# Altium schematic sheet PowerConverter.SchDoc
size 594 x 420 mm; Address1: Address1; Address2: Address2; Address3: Address3; Address4: Address4; DocumentNumber: АБВГ.123456.001 Э3; SheetNumber: 1; SheetTotal: 2; Scale: 1:1; DocumentType: Схема электрическая принципиальная; FirstReferrence: АБВГ.123456.001
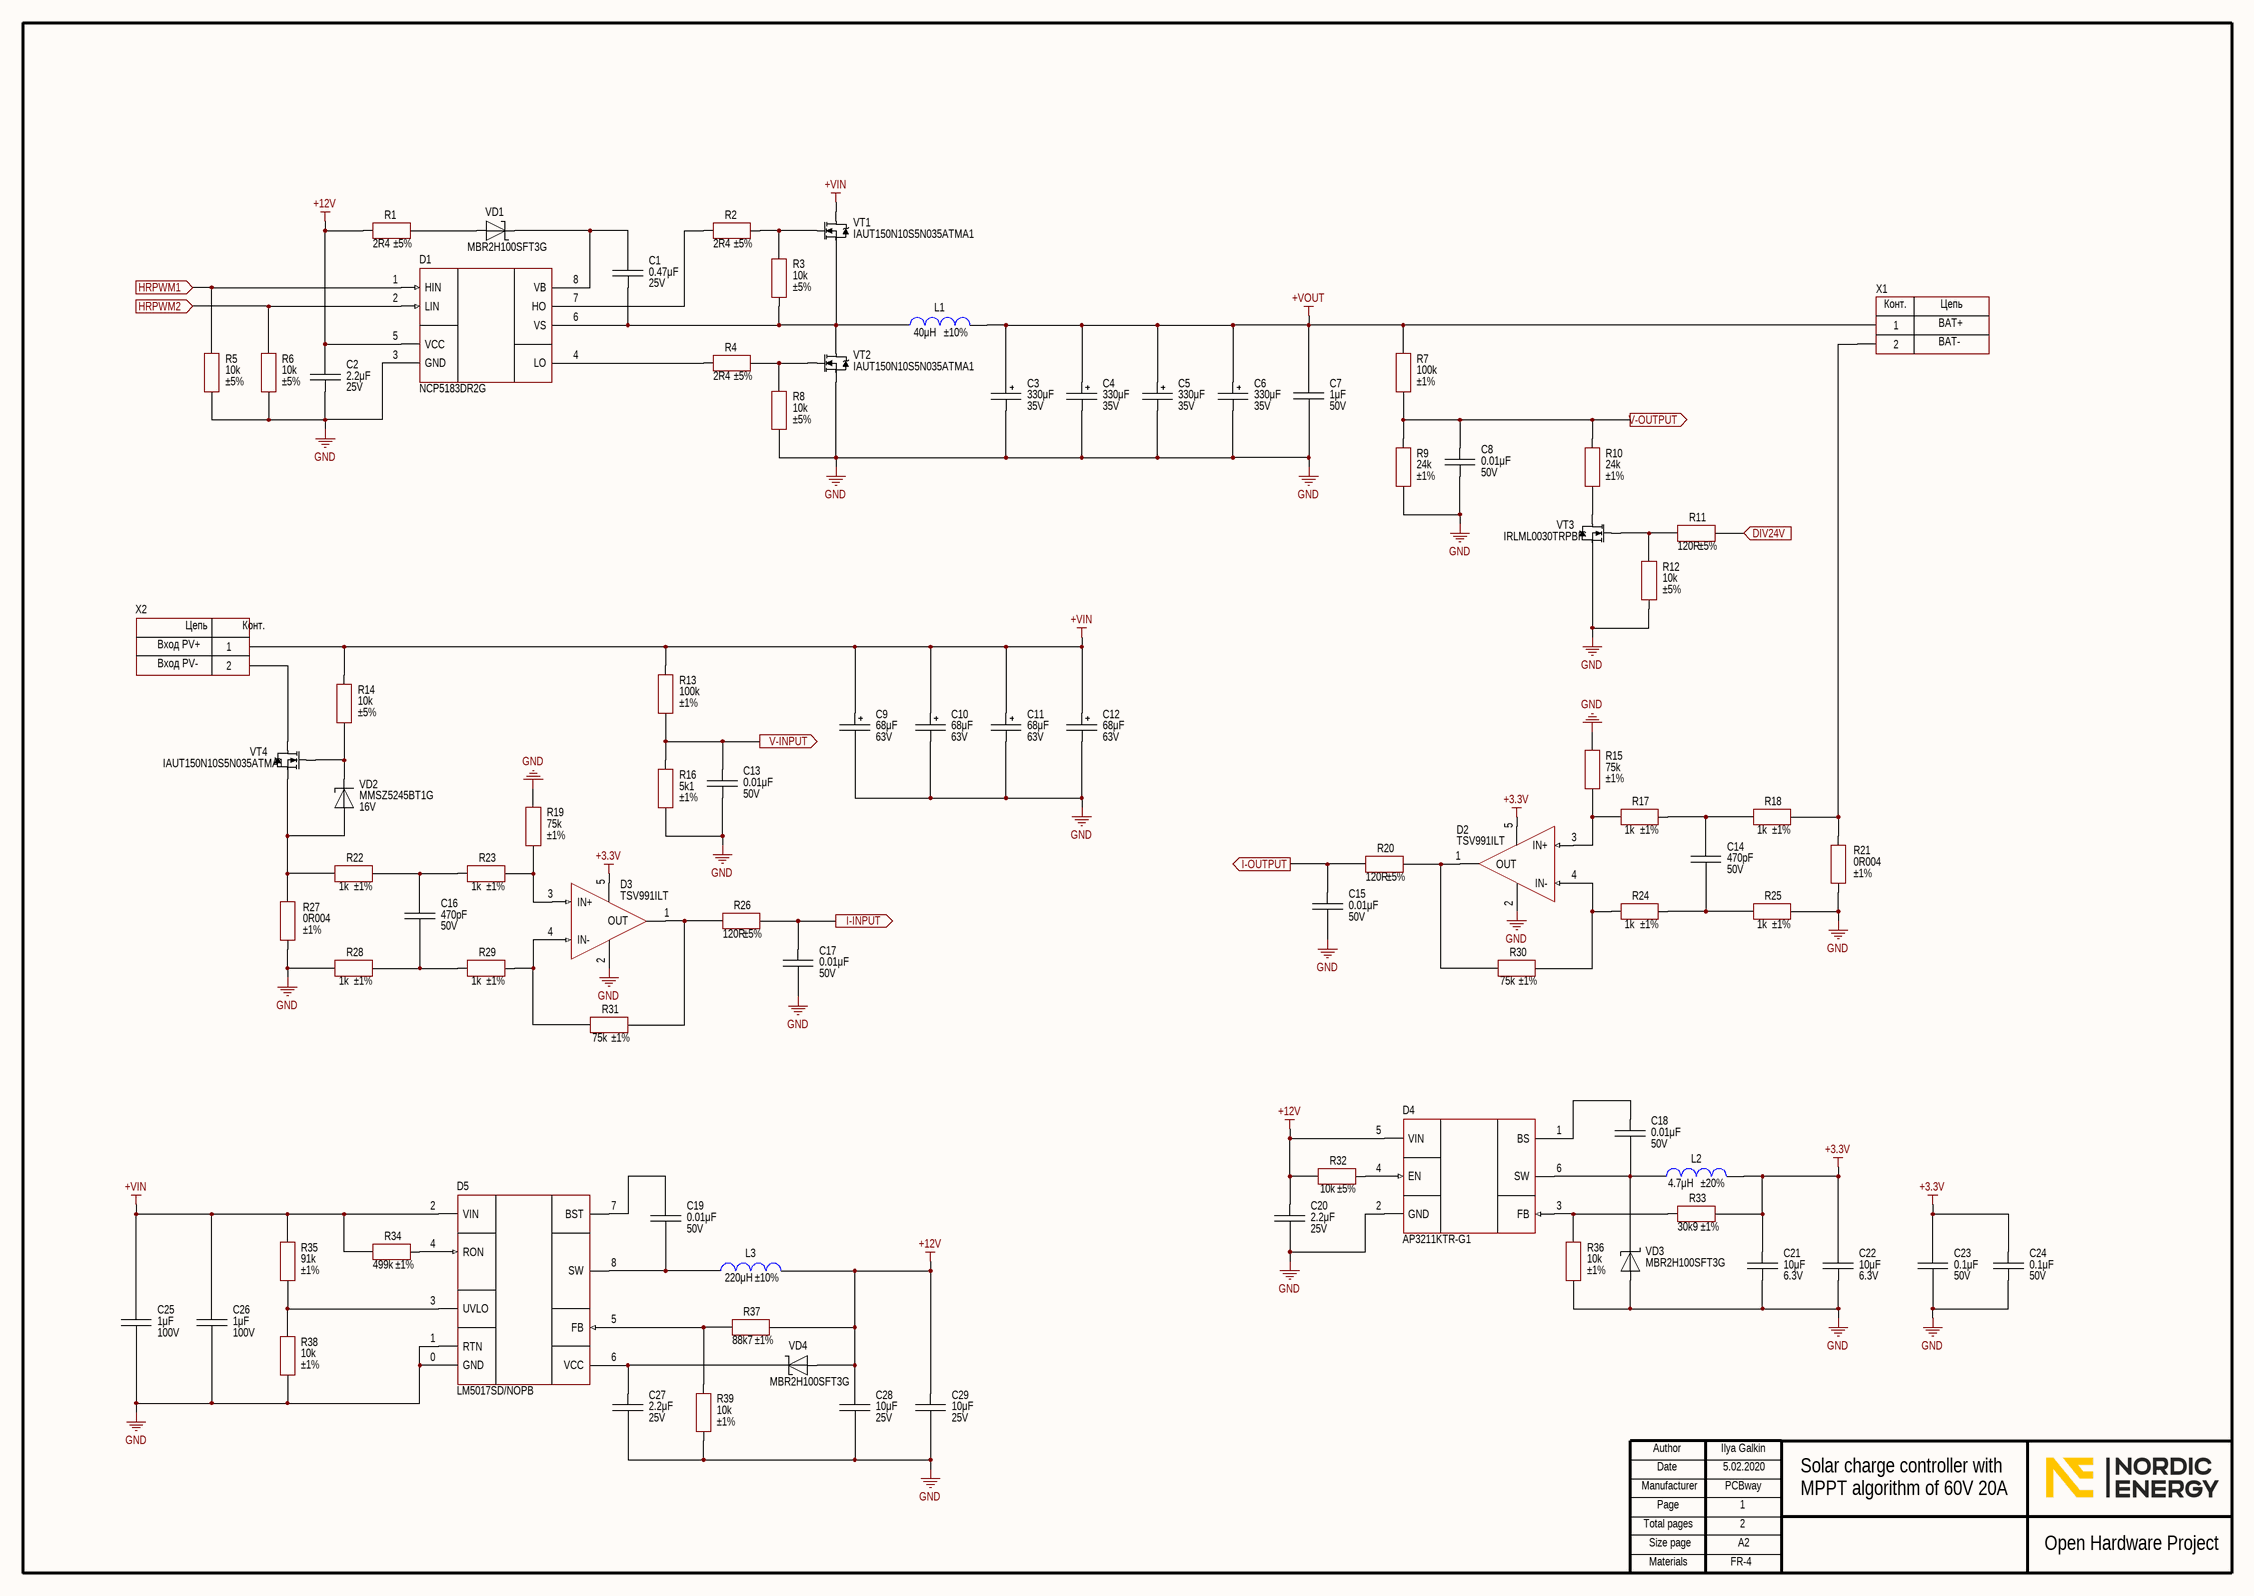
[diagram p0: PowerConverter.SchDoc]

## Parts
C1  value 0.47μF  Voltage: 25V  [CAP: 0805]
C2  value 2.2μF  Voltage: 25V  [CAP: 0805]
C3  value 330μF  Voltage: 35V  [CAP: D10C5H12.5]
C4  value 330μF  Voltage: 35V  [CAP: D10C5H12.5]
C5  value 330μF  Voltage: 35V  [CAP: D10C5H12.5]
C6  value 330μF  Voltage: 35V  [CAP: D10C5H12.5]
C7  value 1μF  Voltage: 50V  [CAP: 0805]
C8  value 0.01μF  Voltage: 50V  [CAP: 0805]
C9  value 68μF  Voltage: 63V  [CAP: D10C5H12.5]
C10  value 68μF  Voltage: 63V  [CAP: D10C5H12.5]
C11  value 68μF  Voltage: 63V  [CAP: D10C5H12.5]
C12  value 68μF  Voltage: 63V  [CAP: D10C5H12.5]
C13  value 0.01μF  Voltage: 50V  [CAP: 0805]
C14  value 470pF  Voltage: 50V  [CAP: 0805]
C15  value 0.01μF  Voltage: 50V  [CAP: 0805]
C16  value 470pF  Voltage: 50V  [CAP: 0805]
C17  value 0.01μF  Voltage: 50V  [CAP: 0805]
C18  value 0.01μF  Voltage: 50V  [CAP: 0805]
C19  value 0.01μF  Voltage: 50V  [CAP: 0805]
C20  value 2.2μF  Voltage: 25V  [CAP: 0805]
C21  value 10μF  Voltage: 6.3V  [CAP: 0805]
C22  value 10μF  Voltage: 6.3V  [CAP: 0805]
C23  value 0.1μF  Voltage: 50V  [CAP: 0805]
C24  value 0.1μF  Voltage: 50V  [CAP: 0805]
C25  value 1μF  Voltage: 100V  [CAP: 1206]
C26  value 1μF  Voltage: 100V  [CAP: 1206]
C27  value 2.2μF  Voltage: 25V  [CAP: 0805]
C28  value 10μF  Voltage: 25V  [CAP: 1206]
C29  value 10μF  Voltage: 25V  [CAP: 1206]
D1  (no value)  [8-SOIC]
D2  (no value)  [SOT23-5]
D3  (no value)  [SOT23-5]
D4  (no value)  [SOT23-6]
D5  PartNumber: LM5017SD/NOPB  [8-WSON (4x4)]
L1  value 40μH  Tolerance: ±10%  [IND: R32.8/20.1/10.7 (L)]
L2  value 4.7μH  Tolerance: ±20%  [IND: SDR0403]
L3  value 220μH  Tolerance: ±10%  [IND: SDR0805]
R1  value 2R4  Tolerance: ±5%  [RES: 0805]
R2  value 2R4  Tolerance: ±5%  [RES: 0805]
R3  value 10k  Tolerance: ±5%  [RES: 0805]
R4  value 2R4  Tolerance: ±5%  [RES: 0805]
R5  value 10k  Tolerance: ±5%  [RES: 0805]
R6  value 10k  Tolerance: ±5%  [RES: 0805]
R7  value 100k  Tolerance: ±1%  [RES: 0805]
R8  value 10k  Tolerance: ±5%  [RES: 0805]
R9  value 24k  Tolerance: ±1%  [RES: 0805]
R10  value 24k  Tolerance: ±1%  [RES: 0805]
R11  value 120R  Tolerance: ±5%  [RES: 0805]
R12  value 10k  Tolerance: ±5%  [RES: 0805]
R13  value 100k  Tolerance: ±1%  [RES: 0805]
R14  value 10k  Tolerance: ±5%  [RES: 0805]
R15  value 75k  Tolerance: ±1%  [RES: 0805]
R16  value 5k1  Tolerance: ±1%  [RES: 0805]
R17  value 1k  Tolerance: ±1%  [RES: 0805]
R18  value 1k  Tolerance: ±1%  [RES: 0805]
R19  value 75k  Tolerance: ±1%  [RES: 0805]
R20  value 120R  Tolerance: ±5%  [RES: 0805]
R21  value 0R004  Tolerance: ±1%  [RES: CSS2H (2512)]
R22  value 1k  Tolerance: ±1%  [RES: 0805]
R23  value 1k  Tolerance: ±1%  [RES: 0805]
R24  value 1k  Tolerance: ±1%  [RES: 0805]
R25  value 1k  Tolerance: ±1%  [RES: 0805]
R26  value 120R  Tolerance: ±5%  [RES: 0805]
R27  value 0R004  Tolerance: ±1%  [RES: CSS2H (2512)]
R28  value 1k  Tolerance: ±1%  [RES: 0805]
R29  value 1k  Tolerance: ±1%  [RES: 0805]
R30  value 75k  Tolerance: ±1%  [RES: 0805]
R31  value 75k  Tolerance: ±1%  [RES: 0805]
R32  value 10k  Tolerance: ±5%  [RES: 0805]
R33  value 30k9  Tolerance: ±1%  [RES: 0805]
R34  value 499k  Tolerance: ±1%  [RES: 0805]
R35  value 91k  Tolerance: ±1%  [RES: 0805]
R36  value 10k  Tolerance: ±1%  [RES: 0805]
R37  value 88k7  Tolerance: ±1%  [RES: 0805]
R38  value 10k  Tolerance: ±1%  [RES: 0805]
R39  value 10k  Tolerance: ±1%  [RES: 0805]
VD1  PartNumber: MBR2H100SFT3G  [DIODE: SOD123F]
VD2  Voltage: 16V  PartNumber: MMSZ5245BT1G  [DIODE: SOD123]
VD3  PartNumber: MBR2H100SFT3G  [DIODE: SOD123F]
VD4  PartNumber: MBR2H100SFT3G  [DIODE: SOD123F]
VT1  PartNumber: IAUT150N10S5N035ATMA1  [HSOF-8-1]
VT2  PartNumber: IAUT150N10S5N035ATMA1  [HSOF-8-1]
VT3  PartNumber: IRLML0030TRPBF  [SOT23]
VT4  PartNumber: IAUT150N10S5N035ATMA1  [HSOF-8-1]
X1  (no value)  [CON: XT60PW-M]
X2  (no value)  [CON: XT60PW-M]

## Ports
DIV24V (in), HRPWM1 (in), HRPWM2 (in), I-INPUT (out), I-OUTPUT (out), V-INPUT (out), V-OUTPUT (out)

## Nets
+3.3V: C21.2 C22.2 C23.2 C24.2 D2.5(V+) D3.5(V+) L2.1 R33.1
+12V: C2.2 C20.2 C28.2 C29.2 D1.5(VCC) D4.5(VIN) L3.1 R1.2 R32.2 R37.1 VD4.1
+VIN: C9.1 C10.1 C11.1 C12.1 C25.2 C26.2 D5.2(VIN) R13.2 R14.2 R34.2 R35.2 VT1.2(D) X2.1
+VOUT: C3.1 C4.1 C5.1 C6.1 C7.2 L1.1 R7.2 X1.1
GND: C2.1 C3.2 C4.2 C5.2 C6.2 C7.1 C8.1 C9.2 C10.2 C11.2 C12.2 C13.1 C15.1 C17.1 C20.1 C21.1 C22.1 C23.1 C24.1 C25.1 C26.1 C27.1 C28.1 C29.1 D1.3(GND) D2.2(V-) D3.2(V-) D4.2(GND) D5.0(GND) D5.1(RTN) R5.1 R6.1 R8.1 R9.1 R12.1 R15.2 R16.1 R19.2 R21.1 R25.1 R27.1 R28.2 R36.1 R38.1 R39.1 VD3.1 VT2.3(S) VT3.2(S)
DIV24V: R11.1 ; port DIV24V
HRPWM1: D1.1(HIN) R5.2 ; port HRPWM1
HRPWM2: D1.2(LIN) R6.2 ; port HRPWM2
I-INPUT: C17.2 R26.1 ; port I-INPUT
I-OUTPUT: C15.2 R20.2 ; port I-OUTPUT
V-INPUT: C13.2 R13.1 R16.2 ; port V-INPUT
V-OUTPUT: C8.2 R7.1 R9.2 R10.2 ; port V-OUTPUT
NetC1_1: C1.1 D1.6(VS) L1.2 R3.1 VT1.3(S) VT2.2(D)
NetC1_2: C1.2 D1.8(VB) VD1.2
NetC14_1: C14.1 R24.1 R25.2
NetC14_2: C14.2 R17.1 R18.2
NetC16_1: C16.1 R28.1 R29.2
NetC16_2: C16.2 R22.1 R23.2
NetC18_1: C18.1 D4.6(SW) L2.2 VD3.2
NetC18_2: C18.2 D4.1(BS)
NetC19_1: C19.1 D5.8(SW) L3.2
NetC19_2: C19.2 D5.7(BST)
NetC27_2: C27.2 D5.6(VCC) VD4.2
NetD1_4: D1.4(LO) R4.2
NetD1_7: D1.7(HO) R2.2
NetD2_1: D2.1(OUT) R20.1 R30.2
NetD2_3: D2.3(IN+) R15.1 R17.2
NetD2_4: D2.4(IN-) R24.2 R30.1
NetD3_1: D3.1(OUT) R26.2 R31.1
NetD3_3: D3.3(IN+) R19.1 R23.1
NetD3_4: D3.4(IN-) R29.1 R31.2
NetD4_3: D4.3(FB) R33.2 R36.2
NetD4_4: D4.4(EN) R32.1
NetD5_3: D5.3(UVLO) R35.1 R38.2
NetD5_4: D5.4(RON) R34.1
NetD5_5: D5.5(FB) R37.2 R39.2
NetR1_1: R1.1 VD1.1
NetR2_1: R2.1 R3.2 VT1.1(G)
NetR4_1: R4.1 R8.2 VT2.1(G)
NetR10_1: R10.1 VT3.3(D)
NetR11_2: R11.2 R12.2 VT3.1(G)
NetR14_1: R14.1 VD2.2(C) VT4.1(G)
NetR18_1: R18.1 R21.2 X1.2
NetR22_2: R22.2 R27.2 VD2.1(A) VT4.3(S)
NetVT4_2: VT4.2(D) X2.2

## Notes on the sheet
- BAT+
- BAT-
- Вход PV+
- Вход PV-
- Ilya Galkin
- 5.02.2020
- PCBway
- 1
- Solar charge controller with
- MPPT algorithm of 60V 20A
- 2
- FR-4
- Author
- Manufacturer
- Date
- Page
- Total pages
- Size page
- A2
- Open Hardware Project
- Materials
- (in symbol Connector_XT_2pin) Цепь; Конт.

## Library data of the parts
C1 = Ceramic_0805: Manufacturer: Samsung; PartNumber: CL21B474KAFNNNG; ValueManufacturerPartNumber: Ceramic capacitor, 0.47μF, X7R, ±10%, 25V, 0805, -55...+125°C; TypeCapacitor: Ceramic capacitor; Tolerance: ±10%; TypeDielectric: X7R; Package: 0805; HelpURL: https://www.digikey.com/product-detail/en/samsung-electro-mechanics/CL21B474KAFNNNG/1276-6480-1-ND/5958108; Temperature: -55...+125°C
C2 C20 C27 = Ceramic_0805: Manufacturer: Samsung; PartNumber: CL21B225KAFNFNE; ValueManufacturerPartNumber: Ceramic capacitor, 2.2μF, X7R, ±10%, 25V, 0805, -55...+125°C; TypeCapacitor: Ceramic capacitor; Tolerance: ±10%; TypeDielectric: X7R; Package: 0805; HelpURL: https://www.digikey.com/product-detail/en/samsung-electro-mechanics/CL21B225KAFNFNE/1276-2953-1-ND/3891039; Temperature: -55...+125°C
C3-C6 = Aluminium: Manufacturer: Panasonic; PartNumber: 35SEK330M; ValueManufacturerPartNumber: Solid polymer capacitor, 330μF, 35V, ±20%, 18mOhm, 13x10x5 mm, -55...+105°C; TypeCapacitor: Solid polymer capacitor; Tolerance: ±20%; Impedance: 18mOhm; Package: 13x10x5 mm; HelpURL: https://www.digikey.com/product-detail/en/panasonic-electronic-components/35SEK330M/P122629-ND/8030545; Temperature: -55...+105°C
C7 = Ceramic_0805: Manufacturer: Samsung; PartNumber: CL21B105KBFNNNG; ValueManufacturerPartNumber: Ceramic capacitor, 1μF, X7R, ±10%, 50V, 0805, -55...+125°C; TypeCapacitor: Ceramic capacitor; Tolerance: ±10%; TypeDielectric: X7R; Package: 0805; HelpURL: https://www.digikey.com/product-detail/en/samsung-electro-mechanics/CL21B105KBFNNNG/1276-6470-1-ND/5958098; Temperature: -55...+125°C
C8 C13 C15 C17-C19 = Ceramic_0805: Manufacturer: Samsung; PartNumber: CL21B103KBANNNC; ValueManufacturerPartNumber: Ceramic capacitor, 0.01μF, X7R, ±10%, 50V, 0805, -55...+125°C; TypeCapacitor: Ceramic capacitor; Tolerance: ±10%; TypeDielectric: X7R; Package: 0805; HelpURL: https://www.digikey.com/product-detail/en/samsung-electro-mechanics/CL21B103KBANNNC/1276-1015-1-ND/3889101; Temperature: -55...+125°C
C9-C12 = Aluminium: Manufacturer: Panasonic; PartNumber: 63SXE68M; ValueManufacturerPartNumber: Solid polymer capacitor, 68μF, 63V, ±20%, 25mOhm, 13x10x5 mm, -55...+105°C; TypeCapacitor: Solid polymer capacitor; Tolerance: ±20%; Impedance: 25mOhm; Package: 13x10x5 mm; HelpURL: https://www.digikey.com/products/en?keywords=63SXE68M; Temperature: -55...+105°C
C14 C16 = Ceramic_0805: Manufacturer: Samsung; PartNumber: CL21B471KBANNNC; ValueManufacturerPartNumber: Ceramic capacitor, 470pF, X7R, ±10%, 50V, 0805, -55...+125°C; TypeCapacitor: Ceramic capacitor; Tolerance: ±10%; TypeDielectric: X7R; Package: 0805; HelpURL: https://www.digikey.com/product-detail/en/samsung-electro-mechanics/CL21B471KBANNNC/1276-1300-1-ND/3889386; Temperature: -55...+125°C
C21 C22 = Ceramic_0805: Manufacturer: Samsung; PartNumber: CL21B106KQQNNNG; ValueManufacturerPartNumber: Ceramic capacitor, 10μF, X7R, ±10%, 6.3V, 0805, -55...+125°C; TypeCapacitor: Ceramic capacitor; Tolerance: ±10%; TypeDielectric: X7R; Package: 0805; HelpURL: https://www.digikey.com/product-detail/en/samsung-electro-mechanics/CL21B106KQQNNNG/1276-6474-1-ND/5958102; Temperature: -55...+125°C
C23 C24 = Ceramic_0805: Manufacturer: Samsung; PartNumber: CL21B104KBCNFNC; ValueManufacturerPartNumber: Ceramic capacitor, 0.1μF, X7R, ±10%, 50V, 0805, -55...+125°C; TypeCapacitor: Ceramic capacitor; Tolerance: ±10%; TypeDielectric: X7R; Package: 0805; HelpURL: https://www.digikey.com/product-detail/en/samsung-electro-mechanics/CL21B104KBCNFNC/1276-2444-1-ND/3890530; Temperature: -55...+125°C
C25 C26 = Ceramic_1206: Manufacturer: Samsung; PartNumber: CL31B105KCHSNNE; ValueManufacturerPartNumber: Ceramic capacitor, 1μF, X7R, ±10%, 100V, 1206, -55...+125°C; TypeCapacitor: Ceramic capacitor; Tolerance: ±10%; TypeDielectric: X7R; Package: 1206; HelpURL: https://www.digikey.com/product-detail/en/samsung-electro-mechanics/CL31B105KCHSNNE/1276-2747-1-ND/3890833; Temperature: -55...+125°C
C28 C29 = Ceramic_1206: Manufacturer: Samsung; PartNumber: CL31B106KAHNNNE; ValueManufacturerPartNumber: Ceramic capacitor, 10μF, X7R, ±10%, 25V, 1206, -55...+125°C; TypeCapacitor: Ceramic capacitor; Tolerance: ±10%; TypeDielectric: X7R; Package: 1206; HelpURL: https://www.digikey.com/product-detail/en/samsung-electro-mechanics/CL31B106KAHNNNE/1276-1804-1-ND/3889890; Temperature: -55...+125°C
D1 = NCP5183DR2G: Gate driver; Manufacturer: ON Semiconductor; ValueManufacturerPartNumber: Half-bridge gate driver, 600V, 500kHz, ±4.3A, supply 9...18V, -40...+125°C, 8-SOIC; VoltageSupply: supply 9...18V; Frequency: 500kHz; CurrentOutput: ±4.3A; VoltageWork: 600V; HelpURL: https://www.digikey.com/product-detail/en/on-semiconductor/NCP5183DR2G/NCP5183DR2GOSCT-ND/7066807; Package: 8-SOIC; ComponentType: Half-bridge gate driver; Temperature: -40...+125°C; PartNumber: NCP5183DR2G
D2 D3 = TSV991ILT: OP amplifier; Manufacturer: STMicroelectronics; ValueManufacturerPartNumber: IC op amplifier, Rail-to-Rail, 20 MHz, 2.7...5.5V, -40...+125°C, SOT23-5; Supply: 2.7...5.5V; OutputType: Rail-to-Rail; GainBandwidth: 20 MHz; HelpURL: https://www.digikey.com/product-detail/en/stmicroelectronics/TSV991ILT/497-6001-1-ND/1578484; Package: SOT23-5; ComponentType: IC op amplifier; Temperature: -40...+125°C; PartNumber: TSV991ILT
D4 = AP3211KTR-G1: Buck converter; Manufacturer: Diodes Incorporated; ValueManufacturerPartNumber: DC/DC buck converter, input 4.5...18V, 1.4MHz, output 0.81...15V, 1.5A, -40...+85°C, SOT23-6; VoltageInput: input 4.5...18V; Frequency: 1.4MHz; CurrentOutput: 1.5A; VoltageOutput: output 0.81...15V; HelpURL: https://www.digikey.com/product-detail/en/diodes-incorporated/AP3211KTR-G1/AP3211KTR-G1DICT-ND/4505305; Package: SOT23-6; ComponentType: DC/DC buck converter; Temperature: -40...+85°C; PartNumber: AP3211KTR-G1
D5 = LM5017SD: Buck converter; Manufacturer: Texas Instruments; ValueManufacturerPartNumber: DC/DC buck converter, input 7.5...100V, 1MHz, output 1.225...90V, 0.6A, -40...+125°C, 8-WSON; VoltageInput: input 7.5...100V; Frequency: 1MHz; CurrentOutput: 0.6A; VoltageOutput: output 1.225...90V; HelpURL: https://www.digikey.com/product-detail/en/texas-instruments/LM5017SD-NOPB/LM5017SD-NOPBCT-ND/3137455; Package: 8-WSON; ComponentType: DC/DC buck converter; Temperature: -40...+125°C
L1 = Inductor_R32.8/20.1/10.7: Manufacturer: Magnetics; PartNumber: 0077548A7; ValueManufacturerPartNumber: Fixed inductor, 40μH, ±10%, R32.8/20.1/10.7, Kool Mu, µ=125, 127 нГн/витков2; TypeInductor: Fixed inductor; TypeMatiriel: Kool Mu; AL: 127 нГн/витков2; MaterialPermeability: µ=125; Package: R32.8/20.1/10.7; HelpURL: http://ferrite.ru/warehouse/r-32-820-110-7-77548-a7.html
L2 = Inductor_SDR0403: Manufacturer: Bourns; PartNumber: SDR0403-4R7ML; ValueManufacturerPartNumber: Fixed inductor, 4.7μH, ±20%, SDR0403, 1.7A, -40...+125°C; TypeInductor: Fixed inductor; MaxCurrent: 1.7A; Package: SDR0403; HelpURL: https://www.digikey.com/product-detail/en/bourns-inc/SDR0403-4R7ML/SDR0403-4R7MLCT-ND/2127096; Temperature: -40...+125°C
L3 = Inductor_SDR0805: Manufacturer: Bourns; PartNumber: SDR0805-221KL; ValueManufacturerPartNumber: Fixed inductor, 220μH, ±10%, SDR0805, 490mA, -40...+125°C; TypeInductor: Fixed inductor; MaxCurrent: 490mA; Package: SDR0805; HelpURL: https://www.digikey.com/product-detail/en/bourns-inc/SDR0805-221KL/SDR0805-221KLCT-ND/2127164; Temperature: -40...+125°C
R1 R2 R4 = Resistor_0805: Manufacturer: Yageo; PartNumber: RC0805JR-072R4L; ValueManufacturerPartNumber: Resistor film, 2R4, ±5%, 0805, 0.125W, -55...+125°C; TypeResistor: Resistor film; Power: 0.125W; Package: 0805; HelpURL: https://www.digikey.com/product-detail/en/yageo/RC0805JR-072R4L/311-2.4ARCT-ND/731220; Temperature: -55...+125°C
R3 R5 R6 R8 R12 R14 R32 = Resistor_0805: Manufacturer: Yageo; PartNumber: RC0805JR-0710KL; ValueManufacturerPartNumber: Resistor film, 10k, ±5%, 0805, 0.125W, -55...+125°C; TypeResistor: Resistor film; Power: 0.125W; Package: 0805; HelpURL: https://www.digikey.com/product-detail/en/yageo/RC0805JR-0710KL/311-10KARCT-ND/731188; Temperature: -55...+125°C
R7 R13 = Resistor_0805: Manufacturer: Yageo; PartNumber: RC0805FR-07100KL; ValueManufacturerPartNumber: Resistor film, 100k, ±1%, 0805, 0.125W, -55...+125°C; TypeResistor: Resistor film; Power: 0.125W; Package: 0805; HelpURL: https://www.digikey.com/product-detail/en/yageo/RC0805FR-07100KL/311-100KCRCT-ND/730491; Temperature: -55...+125°C
R9 R10 = Resistor_0805: Manufacturer: Yageo; PartNumber: RC0805FR-0724KL; ValueManufacturerPartNumber: Resistor film, 24k, ±1%, 0805, 0.125W, -55...+125°C; TypeResistor: Resistor film; Power: 0.125W; Package: 0805; HelpURL: https://www.digikey.com/product-detail/en/yageo/RC0805FR-0724KL/311-24.0KCRCT-ND/730703; Temperature: -55...+125°C
R11 R20 R26 = Resistor_0805: Manufacturer: Yageo; PartNumber: RC0805JR-07120RL; ValueManufacturerPartNumber: Resistor film, 120R, ±5%, 0805, 0.125W, -55...+125°C; TypeResistor: Resistor film; Power: 0.125W; Package: 0805; HelpURL: https://www.digikey.com/product-detail/en/yageo/RC0805JR-07120RL/311-120ARCT-ND/731194; Temperature: -55...+125°C
R15 R19 R30 R31 = Resistor_0805: Manufacturer: Yageo; PartNumber: RC0805FR-0775KL; ValueManufacturerPartNumber: Resistor film, 75k, ±1%, 0805, 0.125W, -55...+125°C; TypeResistor: Resistor film; Power: 0.125W; Package: 0805; HelpURL: https://www.digikey.com/product-detail/en/yageo/RC0805FR-0775KL/311-75.0KCRCT-ND/731080; Temperature: -55...+125°C
R16 = Resistor_0805: Manufacturer: Yageo; PartNumber: RC0805FR-075K1L; ValueManufacturerPartNumber: Resistor film, 5k1, ±1%, 0805, 0.125W, -55...+125°C; TypeResistor: Resistor film; Power: 0.125W; Package: 0805; HelpURL: https://www.digikey.com/product-detail/en/yageo/RC0805FR-075K1L/311-5.10KCRCT-ND/730935; Temperature: -55...+125°C
R17 R18 R22-R25 R28 R29 = Resistor_0805: Manufacturer: Yageo; PartNumber: RC0805FR-071KL; ValueManufacturerPartNumber: Resistor film, 1k, ±1%, 0805, 0.125W, -55...+125°C; TypeResistor: Resistor film; Power: 0.125W; Package: 0805; HelpURL: https://www.digikey.com/product-detail/en/yageo/RC0805FR-071KL/311-1.00KCRCT-ND/730391; Temperature: -55...+125°C
R21 R27 = Shunt: Manufacturer: Bourns; PartNumber: CRE2512-FZ-R004E-3; ValueManufacturerPartNumber: Resistor film, 0R004, ±1%, 2512, 5W, -55...+170°C; TypeResistor: Resistor film; Power: 5W; Package: 2512; HelpURL: https://www.digikey.com/product-detail/en/bourns-inc/CRE2512-FZ-R004E-3/CRE2512-FZ-R004E-3DKR-ND/4900078; Temperature: -55...+170°C
R33 = Resistor_0805: Manufacturer: Yageo; PartNumber: RC0805FR-0730K9L; ValueManufacturerPartNumber: Resistor film, 30k9, ±1%, 0805, 0.125W, -55...+125°C; TypeResistor: Resistor film; Power: 0.125W; Package: 0805; HelpURL: https://www.digikey.com/product-detail/en/yageo/RC0805FR-0730K9L/311-30.9KCRCT-ND/730794; Temperature: -55...+125°C
R34 = Resistor_0805: Manufacturer: Yageo; PartNumber: RC0805FR-07499KL; ValueManufacturerPartNumber: Resistor film, 499k, ±1%, 0805, 0.125W, -55...+125°C; TypeResistor: Resistor film; Power: 0.125W; Package: 0805; HelpURL: https://www.digikey.com/product-detail/en/yageo/RC0805FR-07499KL/311-499KCRCT-ND/730934; Temperature: -55...+125°C
R35 = Resistor_0805: Manufacturer: Yageo; PartNumber: RC0805FR-0791KL; ValueManufacturerPartNumber: Resistor film, 91k, ±1%, 0805, 0.125W, -55...+125°C; TypeResistor: Resistor film; Power: 0.125W; Package: 0805; HelpURL: https://www.digikey.com/product-detail/en/yageo/RC0805FR-0791KL/311-91.0KCRCT-ND/731149; Temperature: -55...+125°C
R36 R38 R39 = Resistor_0805: Manufacturer: Yageo; PartNumber: RC0805FR-0710KL; ValueManufacturerPartNumber: Resistor film, 10k, ±1%, 0805, 0.125W, -55...+125°C; TypeResistor: Resistor film; Power: 0.125W; Package: 0805; HelpURL: https://www.digikey.com/product-detail/en/yageo/RC0805FR-0710KL/311-10.0KCRCT-ND/730482; Temperature: -55...+125°C
R37 = Resistor_0805: Manufacturer: Yageo; PartNumber: RC0805FR-0788K7L; ValueManufacturerPartNumber: Resistor film, 88k7, ±1%, 0805, 0.125W, -55...+125°C; TypeResistor: Resistor film; Power: 0.125W; Package: 0805; HelpURL: https://www.digikey.com/product-detail/en/yageo/RC0805FR-0788K7L/311-88.7KCRCT-ND/731128; Temperature: -55...+125°C
VD1 VD3 VD4 = Schottky_single: Manufacturer: ON Semiconductor; ValueManufacturerPartNumber: Schottky diode, 100V, 2A, 840mV, 15pF, SOD-123F, -55...+150°C; TypeDiode: Schottky diode; Voltage: 100V; Current: 2A; VoltageDrop: 840mV; RecoveryTime: 15pF; Package: SOD-123F; HelpURL: https://www.digikey.com/product-detail/en/on-semiconductor/MBR2H100SFT3G/MBR2H100SFT3GOSCT-ND/3462288; Temperature: -55...+150°C
VD2 = Zener_single: Manufacturer: ON Semiconductor; ValueManufacturerPartNumber: Zener diode, 16V, 500mW, 0.9V, 16Ohm, SOD-123, -55...+150°C; TypeDiode: Zener diode; Current: 500mW; VoltageDrop: 0.9V; RecoveryTime: 16Ohm; Package: SOD-123; HelpURL: https://www.digikey.com/product-detail/en/on-semiconductor/MMSZ5245BT1G/MMSZ5245BT1GOSCT-ND/1139899; Temperature: -55...+150°C
VT1 VT2 VT4 = MOSFET_N_123: Manufacturer: Infineon Technologies; ValueManufacturerPartNumber: MOSFET N-channel transistor, 100V, 150A, 87nC, 166W, 3.5mOhm, 6110pF, 8-HSOF, -55...+175°C; TypeTransistor: MOSFET N-channel transistor; VoltageDS: 100V; CurrentDS: 150A; RDS: 3.5mOhm; GateCharge: 87nC; InputCapacitor: 6110pF; MaxPower: 166W; Package: 8-HSOF; HelpURL: https://www.digikey.com/product-detail/en/infineon-technologies/IAUT150N10S5N035ATMA1/IAUT150N10S5N035ATMA1CT-ND/8818779; Temperature: -55...+175°C
VT3 = MOSFET_N_132: Manufacturer: Infineon Technologies; ValueManufacturerPartNumber: MOSFET N-channel transistor, 30V, 5.3A, 2.6nC, 1.3W, 27mOhm, 382pF, SOT-23, -55...+150°C; TypeTransistor: MOSFET N-channel transistor; VoltageDS: 30V; CurrentDS: 5.3A; RDS: 27mOhm; GateCharge: 2.6nC; InputCapacitor: 382pF; MaxPower: 1.3W; Package: SOT-23; HelpURL: https://www.digikey.com/product-detail/en/infineon-technologies/IRLML0030TRPBF/IRLML0030TRPBFCT-ND/2202231; Temperature: -55...+150°C
X1 X2 = Connector_XT_2pin: Manufacturer: AMASS; ValueManufacturerPartNumber: Power connector, 2pin, 7.2mm, 500V, 60A; PartNumber: XT60PW-M; TypeConnector: Power connector; VoltageMax: 500V; Pitch: 7.2mm; CurrentMax: 60A; Multichannel: 2pin; CommentText: "Разъем"; HelpURL: https://lcsc.com/product-detail/Connectors_Changzhou-Amass-Elec-XT60PW-M_C98732.html